# Altium schematic sheet 13 Proc Gnd.SchDoc
size 420 x 297 mm
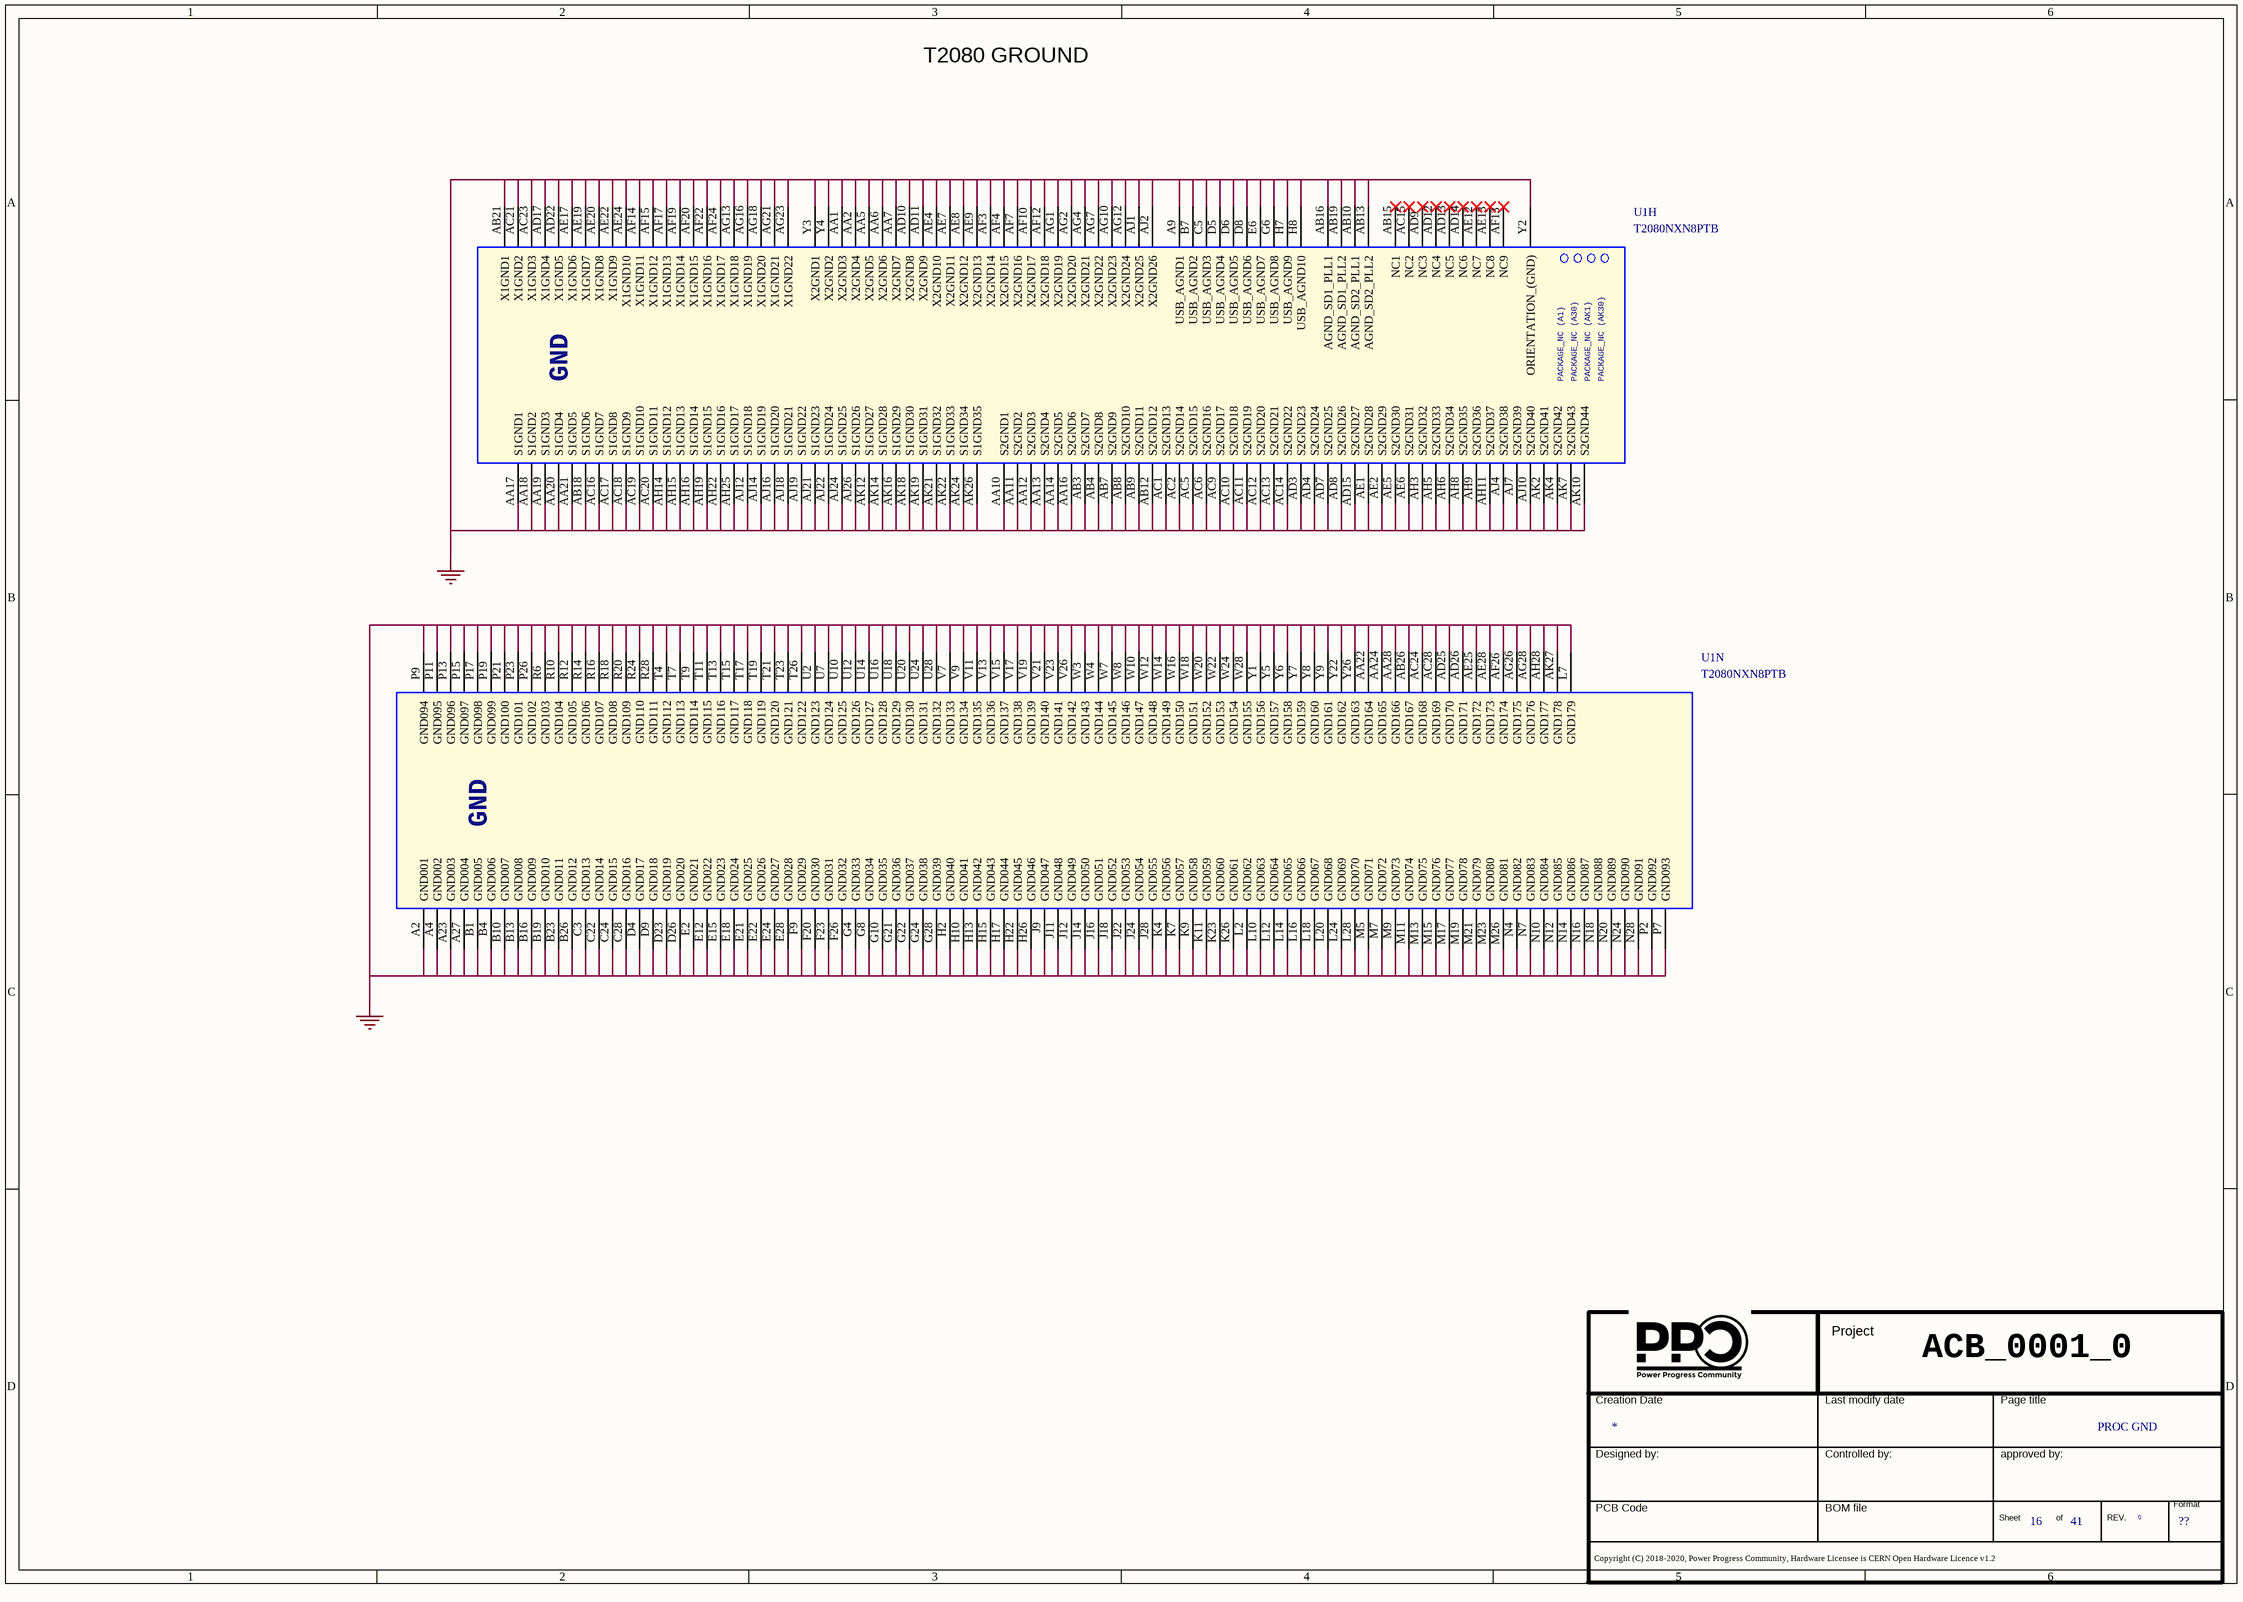
[diagram p0: 13 Proc Gnd.SchDoc]

## Parts
*  Doc: PROC GND  Page Count: 41  Page Number: 16  Page Size: ??  RevCode: 0  (hidden comment: Title_block_PPC)  (graphical)
U1  T2080NXN8PTB  [bga]  (parts H,N of 14)

## Nets
GND: U1.A2(GND001) U1.A4(GND002) U1.A9(USB_AGND1) U1.A23(GND003) U1.A27(GND004) U1.AA1(X2GND3) U1.AA2(X2GND4) U1.AA5(X2GND5) U1.AA6(X2GND6) U1.AA7(X2GND7) U1.AA10(S2GND1) U1.AA11(S2GND2) U1.AA12(S2GND3) U1.AA13(S2GND4) U1.AA14(S2GND5) U1.AA16(S2GND6) U1.AA17(S1GND1) U1.AA18(S1GND2) U1.AA19(S1GND3) U1.AA20(S1GND4) U1.AA21(S1GND5) U1.AA22(GND164) U1.AA24(GND165) U1.AA28(GND166) U1.AB3(S2GND7) U1.AB4(S2GND8) U1.AB7(S2GND9) U1.AB8(S2GND10) U1.AB9(S2GND11) U1.AB10(AGND_SD2_PLL1) U1.AB12(S2GND12) U1.AB13(AGND_SD2_PLL2) U1.AB16(AGND_SD1_PLL1) U1.AB18(S1GND6) U1.AB19(AGND_SD1_PLL2) U1.AB21(X1GND1) U1.AB26(GND167) U1.AC1(S2GND13) U1.AC2(S2GND14) U1.AC5(S2GND15) U1.AC6(S2GND16) U1.AC9(S2GND17) U1.AC10(S2GND18) U1.AC11(S2GND19) U1.AC12(S2GND20) U1.AC13(S2GND21) U1.AC14(S2GND22) U1.AC16(S1GND7) U1.AC17(S1GND8) U1.AC18(S1GND9) U1.AC19(S1GND10) U1.AC20(S1GND11) U1.AC21(X1GND2) U1.AC23(X1GND3) U1.AC24(GND168) U1.AC28(GND169) U1.AD3(S2GND23) U1.AD4(S2GND24) U1.AD7(S2GND25) U1.AD8(S2GND26) U1.AD10(X2GND8) U1.AD11(X2GND9) U1.AD15(S2GND27) U1.AD17(X1GND4) U1.AD22(X1GND5) U1.AD25(GND170) U1.AD26(GND171) U1.AE1(S2GND28) U1.AE2(S2GND29) U1.AE4(X2GND10) U1.AE5(S2GND30) U1.AE6(S2GND31) U1.AE7(X2GND11) U1.AE8(X2GND12) U1.AE9(X2GND13) U1.AE17(X1GND6) U1.AE19(X1GND7) U1.AE20(X1GND8) U1.AE22(X1GND9) U1.AE24(X1GND10) U1.AE25(GND172) U1.AE28(GND173) U1.AF3(X2GND14) U1.AF4(X2GND15) U1.AF7(X2GND16) U1.AF10(X2GND17) U1.AF12(X2GND18) U1.AF14(X1GND11) U1.AF15(X1GND12) U1.AF17(X1GND13) U1.AF19(X1GND14) U1.AF20(X1GND15) U1.AF22(X1GND16) U1.AF24(X1GND17) U1.AF26(GND174) U1.AG1(X2GND19) U1.AG2(X2GND20) U1.AG4(X2GND21) U1.AG7(X2GND22) U1.AG10(X2GND23) U1.AG12(X2GND24) U1.AG13(X1GND18) U1.AG16(X1GND19) U1.AG18(X1GND20) U1.AG21(X1GND21) U1.AG23(X1GND22) U1.AG26(GND175) U1.AG28(GND176) U1.AH3(S2GND32) U1.AH5(S2GND33) U1.AH6(S2GND34) U1.AH8(S2GND35) U1.AH9(S2GND36) U1.AH11(S2GND37) U1.AH14(S1GND12) U1.AH15(S1GND13) U1.AH16(S1GND14) U1.AH19(S1GND15) U1.AH22(S1GND16) U1.AH25(S1GND17) U1.AH28(GND177) U1.AJ1(X2GND25) U1.AJ2(X2GND26) U1.AJ4(S2GND38) U1.AJ7(S2GND39) U1.AJ10(S2GND40) U1.AJ12(S1GND18) U1.AJ14(S1GND19) U1.AJ16(S1GND20) U1.AJ18(S1GND21) U1.AJ19(S1GND22) U1.AJ21(S1GND23) U1.AJ22(S1GND24) U1.AJ24(S1GND25) U1.AJ26(S1GND26) U1.AK2(S2GND41) U1.AK4(S2GND42) U1.AK7(S2GND43) U1.AK10(S2GND44) U1.AK12(S1GND27) U1.AK14(S1GND28) U1.AK16(S1GND29) U1.AK18(S1GND30) U1.AK19(S1GND31) U1.AK21(S1GND32) U1.AK22(S1GND33) U1.AK24(S1GND34) U1.AK26(S1GND35) U1.AK27(GND178) U1.B1(GND005) U1.B4(GND006) U1.B7(USB_AGND2) U1.B10(GND007) U1.B13(GND008) U1.B16(GND009) U1.B19(GND010) U1.B23(GND011) U1.B26(GND012) U1.C3(GND013) U1.C5(USB_AGND3) U1.C22(GND014) U1.C24(GND015) U1.C28(GND016) U1.D4(GND017) U1.D5(USB_AGND4) U1.D6(USB_AGND5) U1.D8(USB_AGND6) U1.D9(GND018) U1.D23(GND019) U1.D26(GND020) U1.E2(GND021) U1.E6(USB_AGND7) U1.E12(GND022) U1.E15(GND023) U1.E18(GND024) U1.E21(GND025) U1.E22(GND026) U1.E24(GND027) U1.E28(GND028) U1.F9(GND029) U1.F20(GND030) U1.F23(GND031) U1.F26(GND032) U1.G4(GND033) U1.G6(USB_AGND8) U1.G8(GND034) U1.G10(GND035) U1.G21(GND036) U1.G22(GND037) U1.G24(GND038) U1.G28(GND039) U1.H2(GND040) U1.H7(USB_AGND9) U1.H8(USB_AGND10) U1.H10(GND041) U1.H13(GND042) U1.H15(GND043) U1.H17(GND044) U1.H22(GND045) U1.H26(GND046) U1.J9(GND047) U1.J11(GND048) U1.J12(GND049) U1.J14(GND050) U1.J16(GND051) U1.J18(GND052) U1.J22(GND053) U1.J24(GND054) U1.J28(GND055) U1.K4(GND056) U1.K7(GND057) U1.K9(GND058) U1.K11(GND059) U1.K23(GND060) U1.K26(GND061) U1.L2(GND062) U1.L7(GND179) U1.L10(GND063) U1.L12(GND064) U1.L14(GND065) U1.L16(GND066) U1.L18(GND067) U1.L20(GND068) U1.L24(GND069) U1.L28(GND070) U1.M5(GND071) U1.M7(GND072) U1.M9(GND073) U1.M11(GND074) U1.M13(GND075) U1.M15(GND076) U1.M17(GND077) U1.M19(GND078) U1.M21(GND079) U1.M23(GND080) U1.M26(GND081) U1.N4(GND082) U1.N7(GND083) U1.N10(GND084) U1.N12(GND085) U1.N14(GND086) U1.N16(GND087) U1.N18(GND088) U1.N20(GND089) U1.N24(GND090) U1.N28(GND091) U1.P2(GND092) U1.P7(GND093) U1.P9(GND094) U1.P11(GND095) U1.P13(GND096) U1.P15(GND097) U1.P17(GND098) U1.P19(GND099) U1.P21(GND100) U1.P23(GND101) U1.P26(GND102) U1.R6(GND103) U1.R10(GND104) U1.R12(GND105) U1.R14(GND106) U1.R16(GND107) U1.R18(GND108) U1.R20(GND109) U1.R24(GND110) U1.R28(GND111) U1.T4(GND112) U1.T7(GND113) U1.T9(GND114) U1.T11(GND115) U1.T13(GND116) U1.T15(GND117) U1.T17(GND118) U1.T19(GND119) U1.T21(GND120) U1.T23(GND121) U1.T26(GND122) U1.U2(GND123) U1.U7(GND124) U1.U10(GND125) U1.U12(GND126) U1.U14(GND127) U1.U16(GND128) U1.U18(GND129) U1.U20(GND130) U1.U24(GND131) U1.U28(GND132) U1.V7(GND133) U1.V9(GND134) U1.V11(GND135) U1.V13(GND136) U1.V15(GND137) U1.V17(GND138) U1.V19(GND139) U1.V21(GND140) U1.V23(GND141) U1.V26(GND142) U1.W3(GND143) U1.W4(GND144) U1.W7(GND145) U1.W8(GND146) U1.W10(GND147) U1.W12(GND148) U1.W14(GND149) U1.W16(GND150) U1.W18(GND151) U1.W20(GND152) U1.W22(GND153) U1.W24(GND154) U1.W28(GND155) U1.Y1(GND156) U1.Y2(ORIENTATION_(GND)) U1.Y3(X2GND1) U1.Y4(X2GND2) U1.Y5(GND157) U1.Y6(GND158) U1.Y7(GND159) U1.Y8(GND160) U1.Y9(GND161) U1.Y22(GND162) U1.Y26(GND163)

Not connected (* = marked no-connect by the designer): U1 AB15(NC1)* AC15(NC2)* AD9(NC3)* AD12(NC4)* AD13(NC5)* AD14(NC6)* AE12(NC7)* AE13(NC8)* AF13(NC9)*

## Notes on the sheet
- T2080 GROUND
- ACB_0001_0
- (in symbol T2080, part H) GND; PACKAGE_NC (A1); PACKAGE_NC (A30); PACKAGE_NC (AK1); PACKAGE_NC (AK30)
- (in symbol T2080, part N) GND
- (in symbol Title_block_PPC) Project; Creation Date; Last modify date; Page title; Designed by:; Controlled by:; approved by:; Format; PCB Code; BOM file; Sheet; of; REV.; Copyright (C) 2018-2020, Power Progress Community, Hardware Licensee is CERN Open Hardware Licence v1.2

## Library data of the parts
* = Title_block_PPC: Title: T2080PCIe; Schematic Page Count: 45; Schematic Page Number: 18; Author: MICETEK; Page Create Date: March  8, 1995; Page Title: ?; Page Modify Date: *
U1 = T2080: QRIQ MPU 1.87GT/s DDR3/3L 4x10GE; Manufacturer 1: NXP; Part Number: MICROPROCESSOR_65; PCB Footprint: BGA896; Vendor: Freescale; RSM: PBGA896-0_8MM-25X25; Distributor 1: MOUSER(841-T2080NXN8PTB); Manufacturer Part Number 1: T2080NXN8PTB; Part Type: 32 BIT; MPN: T2080; TYPE: IC